# EAGLE design FlightComputer (EAGLE 9.6.2)
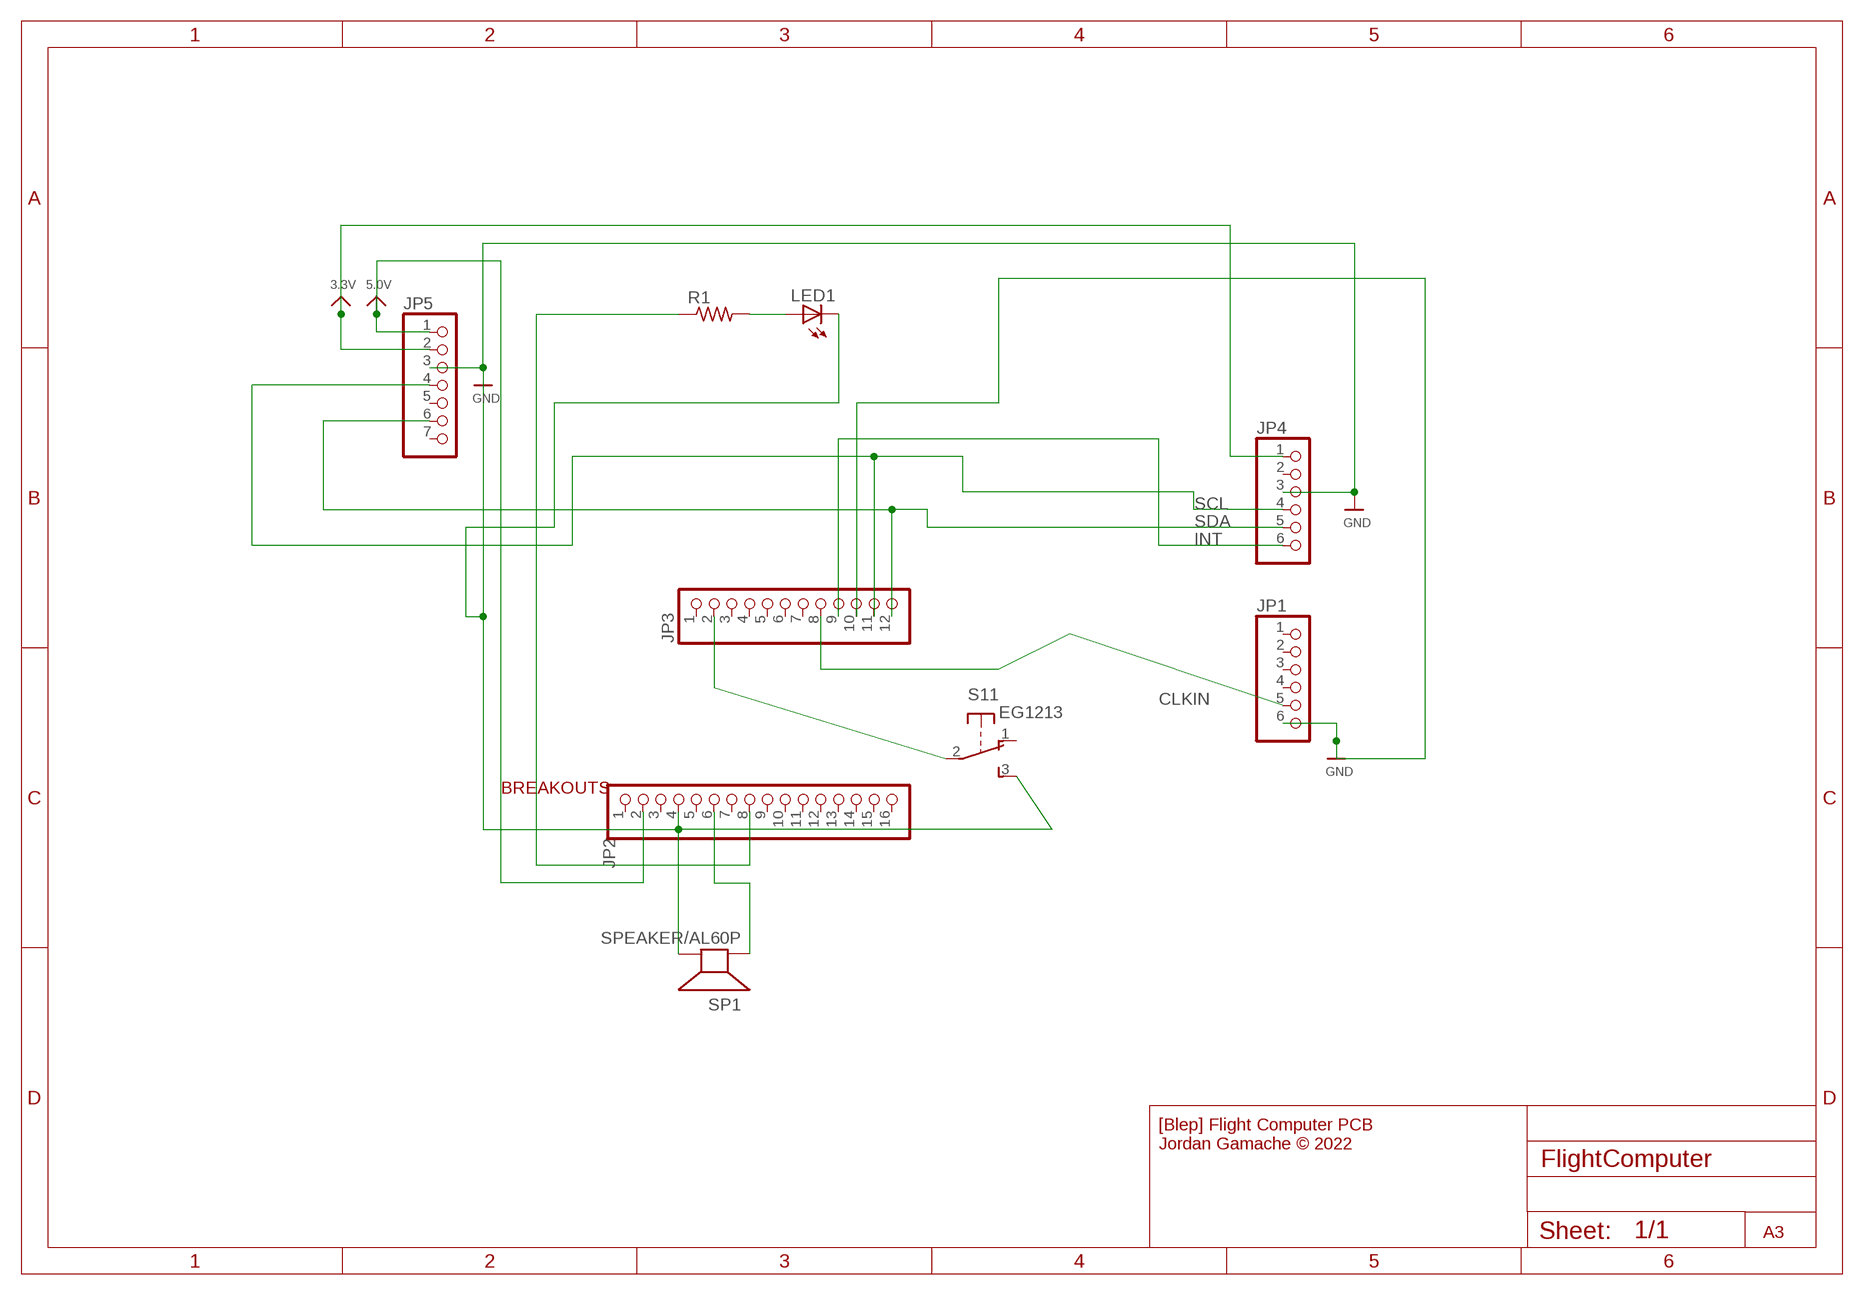
[diagram p0: schematic, sheet 1]

## Parts
JP1  HEADER-1X6ROUND  [1X06_ROUND]
JP2  HEADER-1X16ROUND  [1X16_ROUND]
JP3  HEADER-1X12  [1X12_ROUND]
JP4  HEADER-1X670MIL  [1X06_ROUND_70]
JP5  HEADER-1X770MIL  [1X07_ROUND_70]
LED1  LED5MM  [LED5MM]
R1  R-US_0207/15  [0207/15]
S1  EG1213  [EG1213]
SP1  SPEAKER/AL60P  [AL60P]

## Nets
3.3V: JP4.1 JP5.2
5.0V: JP2.2 JP5.1
CLKIN: JP1.5 JP3.8
GND: JP1.6 JP2.4 JP3.10 JP4.3 JP5.3 LED1.K(C) S1.3(1:S) SP1.2(-)
INT: JP3.9 JP4.6
N$1: JP2.6 SP1.1(+)
N$2: JP2.8 R1.1
N$3: LED1.A R1.2
N$4: JP3.2 S1.2(1:P)
SCL: JP3.11 JP4.4 JP5.4
SDA: JP3.12 JP4.5 JP5.6
Unconnected: JP1.1 JP1.2 JP1.3 JP1.4 JP2.1 JP2.3 JP2.5 JP2.7 JP2.9 JP2.10 JP2.11 JP2.12 JP2.13 JP2.14 JP2.15 JP2.16 JP3.1 JP3.3 JP3.4 JP3.5 JP3.6 JP3.7 JP4.2 JP5.5 JP5.7 S1.1(1:O) S1.MT1(MT) S1.MT2(MT)

## Notes on the sheet
- BREAKOUTS
- [Blep] Flight Computer PCB 
  Jordan Gamache © 2022
- A3

## Library data of the parts
JP1 JP4 = microbuilder:HEADER-1X6: PIN HEADER
JP2 = microbuilder:HEADER-1X16: PIN HEADER
JP3 = microbuilder:HEADER-1X12
JP5 = microbuilder:HEADER-1X7: PIN HEADER
LED1 = adafruit:LED: LED OSRAM: - CHIPLED LG R971, LG N971, LY N971, LG Q971, LY Q971, LO R971, LY R971 LH N974, LH R974 LS Q976, LO Q976, LY Q976 LO Q996 - Hyper CHIPLED LW Q18S LB Q993, LB Q99A, LB R99A - SideLED LS A670, LO A670, LY A670, LG A670, LP A670 LB A673, LV A673, LT A673, LW A673 LH A674 LY A675 LS A676, LA A676, LO A676, LY A676, LW A676 LS A679, LY A679, LG A679 - Hyper Micro SIDELED® LS Y876, LA Y876, LO Y876, LY Y876 LT Y87S - SmartLED LW L88C, LW L88S LB L89C, LB L89S, LG L890 LS L89K, LO L89K, LY L89K LS L896, LA L896, LO L896, LY L896 - TOPLED LS T670, LO T670, LY T670, LG T670, LP T670 LSG T670, LSP T670, LSY T670, LOP T670, LYG T670 LG T671, LOG T671, LSG T671 LB T673, LV T673, LT T673, LW T673 LH T674 LS T676, LA T676, LO T676, LY T676, LB T676, LH T676, LSB T676, LW T676 LB T67C, LV T67C, LT T67C, LS T67K, LO T67K, LY T67K, LW E67C LS E67B, LA E67B, LO E67B, LY E67B, LB E67C, LV E67C, LT E67C LW T67C LS T679, LY T679, LG T679 LS T770, LO T770, LY T770, LG T770, LP T770 LB T773, LV T773, LT T773, LW T773 LH T774 LS E675, LA E675, LY E675, LS T675 LS T776, LA T776, LO T776, LY T776, LB T776 LHGB T686 LT T68C, LB T68C - Hyper Mini TOPLED® LB M676 - Mini TOPLED Santana® LG M470 LS M47K, LO M47K, LY M47K Source: http://www.osram.convergy.de/
R1 = adafruit:R-US_: RESISTOR, American symbol
S1 = adafruit:EG1213: E-Switch right-angle slide SPDT Part #EG1213 http://www.ladyada.net/library/eagle
SP1 = adafruit:SPEAKER: SPEAKER Source: Buerklin Added PS12 (for part # PS1240 piezo) http://www.ladyada.net/library/pcb/eaglelibrary.html

## Net classes
1 highpower: width 0.406 mm, drill 0.483 mm

## Board
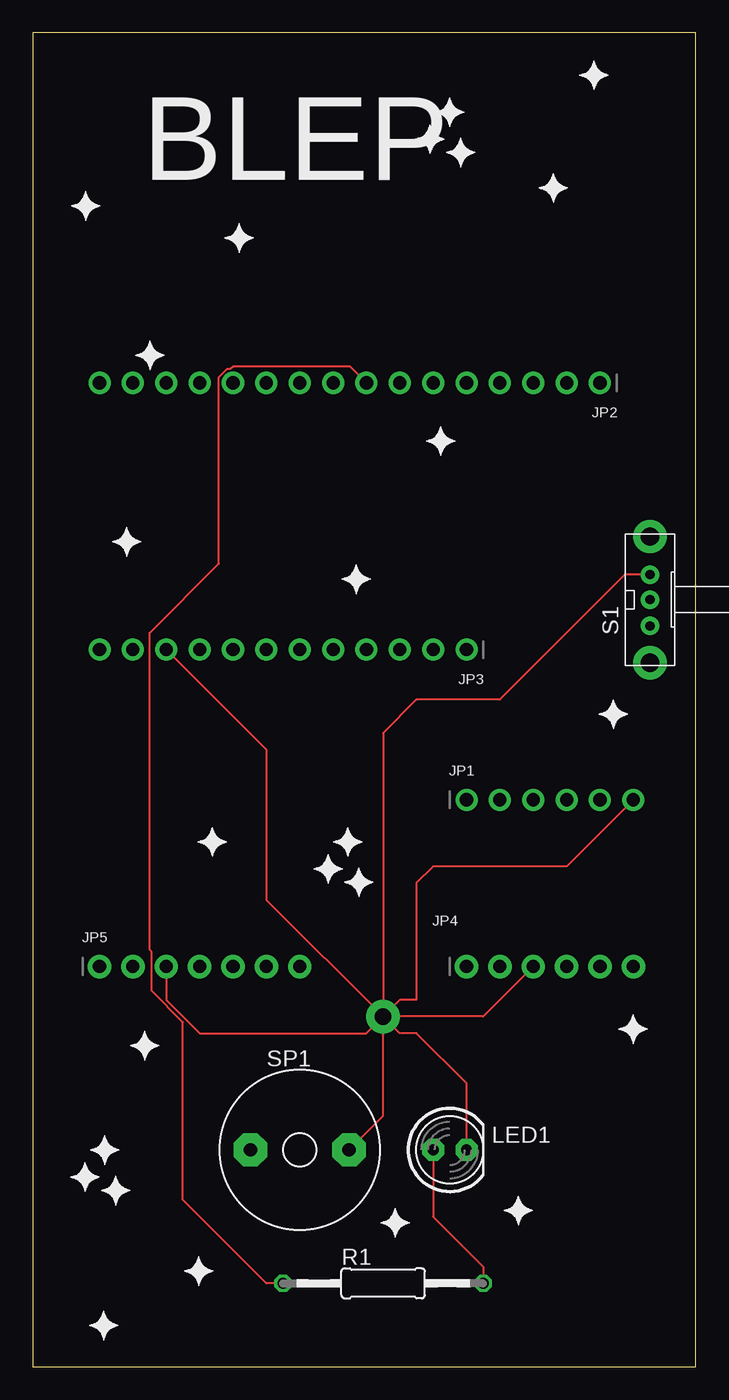
[diagram p1: board, top side]
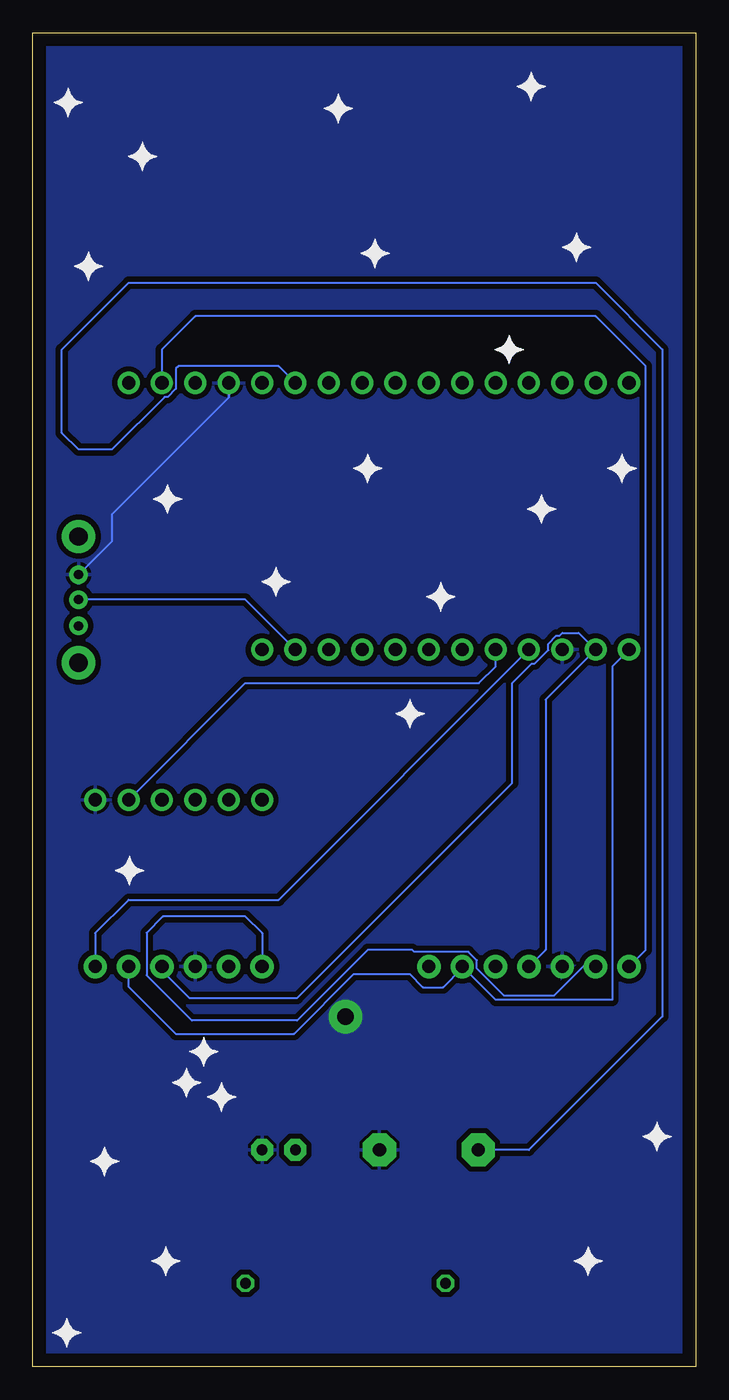
[diagram p2: board, bottom side, seen from below]

Size 50.47 x 101.59 mm. Coordinates in mm from the lower left corner, seen from the top.
Outline: 0,0 50.47,0 50.47,101.59 0,101.59 0,0
Copper layers (1*16): Top 0.035mm / dielectric 1.5mm / Bottom 0.035mm
Design rules "default": minimum track width 6mil, minimum drill 0.35mm, track to track 6mil, track to pad 6mil, pad to pad 6mil, via to via 6mil, smd to smd 6mil, copper to edge 40mil, drill to drill 6mil, minimum pad ring 10mil, minimum via ring 8mil, stop-mask expansion 4mil, vias tented up to drill 0mil, thermal gap 10mil

### Footprints (pad centres in the part's own frame; a part is rotated, then mirrored left to right if it is on the bottom)
1X06_ROUND = drill 1 pad 1.676: 1 -6.35,0; 2 -3.81,0; 3 -1.27,0; 4 1.27,0; 5 3.81,0; 6 6.35,0
1X16_ROUND = drill 1 pad 1.676: 1 -19.05,0; 2 -16.51,0; 3 -13.97,0; 4 -11.43,0; 5 -8.89,0; 6 -6.35,0; 7 -3.81,0; 8 -1.27,0; 9 1.27,0; 10 3.81,0; 11 6.35,0; 12 8.89,0; 13 11.43,0; 14 13.97,0; 15 16.51,0; 16 19.05,0
1X12_ROUND = drill 1 pad 1.676: 1 -13.97,0; 2 -11.43,0; 3 -8.89,0; 4 -6.35,0; 5 -3.81,0; 6 -1.27,0; 7 1.27,0; 8 3.81,0; 9 6.35,0; 10 8.89,0; 11 11.43,0; 12 13.97,0
1X06_ROUND_70 = drill 1 pad 1.778: 1 -6.35,0; 2 -3.81,0; 3 -1.27,0; 4 1.27,0; 5 3.81,0; 6 6.35,0
1X07_ROUND_70 = drill 1 pad 1.778: 1 -7.62,0; 2 -5.08,0; 3 -2.54,0; 4 0,0; 5 2.54,0; 6 5.08,0; 7 7.62,0
LED5MM = drill 0.813 pad 1.676 octagon: A -1.27,0; K 1.27,0
0207/15 = drill 0.813 octagon: 1 -7.62,0; 2 7.62,0
EG1213 = drill 0.7 pad 1.422: 1 -2,0; 2 0,0; 3 1.9,0 | drill 1.4 pad 2.54: MT1 -4.8,0; MT2 4.8,0
AL60P = drill 1.016 pad 2.54 octagon: 1 -3.759,0; 2 3.759,0

### Placement (x,y rotation side)
JP1  39.37,43.18 0 top
JP2  24.13,74.93 180 top
JP3  19.05,54.61 180 top
JP4  39.37,30.48 0 top
JP5  12.7,30.48 0 top
LED1  31.75,16.51 0 top
R1  26.67,6.35 0 top
S1  46.99,58.42 90 top
SP1  20.32,16.51 0 top

### Tracks (layer width: path | path; a pad name or v marks a point on that pad's centre or on a via)
3.3V
  Bottom 0.152: JP5.2 8.58,30.48 10.82,28.25 14.58,28.25 16.66,30.32 16.66,30.94 17.32,31.6 21.44,31.6 21.59,31.75 24.97,31.75 30.35,26.37 38.36,26.37 41.81,29.81 41.81,33.05 40.56,34.29 34.29,34.29 33.02,33.02 JP4.1
5.0V
  Bottom 0.152: JP5.1 3.81,31.75 3.81,76.2 7.62,80.01 38.1,80.01 40.64,77.47 JP2.2
CLKIN
  Bottom 0.152: JP1.5 34.29,52.07 16.51,52.07 15.24,53.34 JP3.8
GND  (via drill 1.27 pad 2.54)
  Top 0.152: JP4.3 34.29,26.67 v26.67,26.67 | LED1.K 33.02,21.59 29.21,25.4 27.94,25.4 v26.67,26.67 | SP1.2 26.67,19.1 v26.67,26.67 | JP5.3 10.16,27.94 12.7,25.4 25.4,25.4 v26.67,26.67 | JP3.10 17.78,46.99 17.78,35.56 v26.67,26.67 | S1.3 45.08,60.32 35.56,50.8 29.21,50.8 26.67,48.26 v26.67,26.67 | JP1.6 40.64,38.1 30.48,38.1 29.21,36.83 29.21,27.94 27.94,27.94 v26.67,26.67
  Bottom 0.152: JP2.4 35.56,73.8 44.45,64.91 44.45,62.86 S1.3
  pour Bottom (isolate 0.406): 0,101.6 50.8,101.6 50.8,0 0,0
INT
  Bottom 0.152: JP3.9 31.75,35.56 43.18,35.56 45.72,33.02 JP4.6
N$1
  Bottom 0.152: JP2.6 31.75,76.2 39.37,76.2 39.57,76 39.57,74.49 40.2,73.86 40.44,73.86 44.45,69.85 46.99,69.85 48.26,71.12 48.26,77.47 43.18,82.55 7.62,82.55 2.54,77.47 2.54,26.67 12.7,16.51 SP1.1
N$2
  Top 0.152: R1.1 17.78,6.35 11.43,12.7 11.43,26.24 9.04,28.63 9.04,31.6 8.89,31.75 8.89,55.88 14.17,61.16 14.17,75.37 14.8,76 15.04,76 15.24,76.2 24.13,76.2 JP2.8
N$3
  Top 0.152: LED1.A 30.48,11.43 34.29,7.62 R1.2
N$4
  Bottom 0.152: JP3.2 34.29,58.42 S1.2
SCL
  Bottom 0.152: JP5.4 11.43,31.75 11.43,50.8 JP3.11 7.64,54.61 8.91,55.88 10.16,55.88 10.36,55.68 10.6,55.68 11.23,55.05 11.23,54.58 12.26,53.54 12.5,53.54 13.97,52.07 13.97,44.45 30.33,28.09 38.56,28.09 40.64,30.17 JP4.4
SDA
  Bottom 0.152: JP3.12 6.35,53.34 6.35,27.94 15.24,27.94 JP5.6 17.78,30.35 19.23,28.91 20.78,28.91 21.77,29.9 26.04,29.9 30.58,25.35 39.6,25.35 43.18,28.93 JP4.5

### Text on the board
tPlace: BLEP